# Altium schematic sheet LCL.SchDoc: Local Supply
size A3; CheckedBy: (not checked); Author: P. Kuligowski
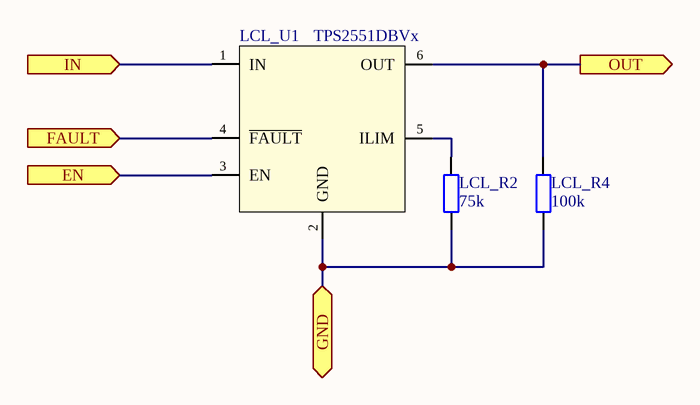
[diagram p0: LCL.SchDoc]

## Parts
LCL_R2  75k  [SMD_Resistor_0603]
LCL_R4  100k  [SMD_Resistor_0603]
LCL_U1  TPS2551DBVx  [SOT23-6]

## Ports
EN (in), FAULT (in), GND, IN (in), OUT (out)

## Nets
EN: LCL_U1.3(EN) ; port EN
FAULT: LCL_U1.4(~{FAULT}) ; port FAULT
GND: LCL_R2.1 LCL_R4.1 LCL_U1.2(GND) ; port GND
IN: LCL_U1.1(IN) ; port IN
OUT: LCL_R4.2 LCL_U1.6(OUT) ; port OUT
NetLCL_R2_2: LCL_R2.2 LCL_U1.5(ILIM)

## Notes on the sheet
- Title:
- Project:
- Author:
- Model:
- Document Number:
- Checked by:
- Rev:
- Date:
- Approved by:
- Sheet:
- of
- File name:

## Library data of the parts
LCL_R2 LCL_R4 = Res: Package: 0603
  LCL_R2: Value: 75k
  LCL_R4: Value: 100k
LCL_U1 = TPS2551DBVx: Adjustable Current-Limited Power-Distribution Switch.; Manufacturer: Texas Instruments; Value: TPS2551DBVx